# EAGLE schematic Schematics (EAGLE 7.5.0)
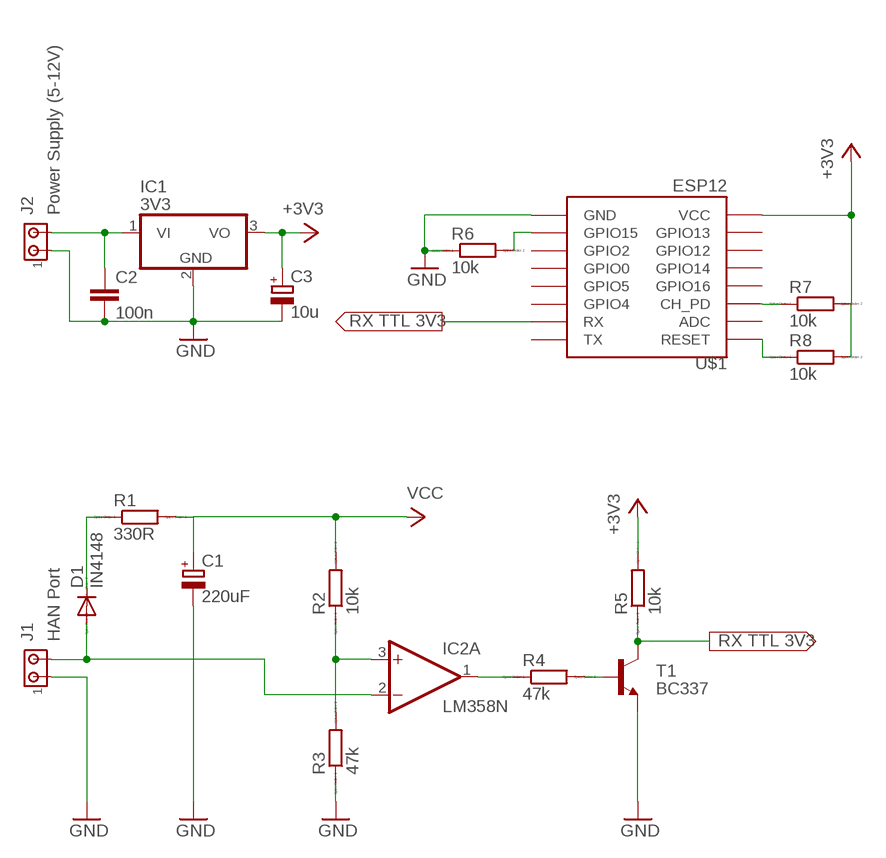
[diagram p0: schematic, sheet 1]

## Parts
C1  220uF  CPOL-EUE3.5-10  [E3,5-10]
C2  100n  C-EU025-040X050  [C025-040X050]
C3  10u  CPOL-EUB45181A  [B45181A]
D1  IN4148  1N4148DO35-7  [DO35-7]
IC1  3V3  7805TV  [TO220V]
IC2  LM358N  [DIL08]
J1  HAN Port  MTA02-156  [1X2MTA]
J2  Power Supply (5-12V)  MTA02-156  [1X2MTA]
R1  330R  R0207/10  [0207/10]
R2  10k  R0207/10  [0207/10]
R3  47k  R0207/10  [0207/10]
R4  47k  R0207/10  [0207/10]
R5  10k  R0207/10  [0207/10]
R6  10k  R0207/10  [0207/10]
R7  10k  R0207/10  [0207/10]
R8  10k  R0207/10  [0207/10]
T1  BC337  [TO92]
U$1  ESP12  [ESP12]

## Nets
+3V3: C3.+ IC1.3(VO) R5.2 R7.2 R8.2 U$1.VCC
GND: C1.- C2.2 C3.- IC1.2(GND) J1.1 J2.1 R3.1 R6.1 T1.1(E) U$1.GND
N$1: D1.A IC2.2(A:-IN) J1.2
N$2: D1.C R1.1
N$3: R7.1 U$1.CH_PD
N$4: C2.1 IC1.1(VI) J2.2
N$5: IC2.3(A:+IN) R2.1 R3.2
N$6: IC2.1(A:OUT) R4.1
N$7: R4.2 T1.2(B)
N$8: R5.1 T1.3(C)
N$9: R6.2 U$1.GPIO15
N$10: R8.1 U$1.RESET
N$11: U$1.RX
VCC: C1.+ R1.2 R2.2
Unconnected: IC2.5(B:+IN) IC2.6(B:-IN) IC2.7(B:OUT) U$1.ADC U$1.GPIO0 U$1.GPIO2 U$1.GPIO4 U$1.GPIO5 U$1.GPIO12 U$1.GPIO13 U$1.GPIO14 U$1.GPIO16 U$1.TX

## Power pins joined to a net without a drawn wire
V+: IC2.8(P:V+)
V-: IC2.4(P:V-)

## Library data of the parts
C1 C3 = resistor:CPOL-EU: POLARIZED CAPACITOR, European symbol
C2 = resistor:C-EU: CAPACITOR, European symbol
D1 = diode:1N4148: DIODE high speed (Philips)
IC1 = linear:78*: Positive VOLTAGE REGULATOR Source: http://cache.national.com/ds/LM/LM78L05.pdf http://www.fairchildsemi.com/ds/LM/LM7805.pdf
IC2 = linear:LM358: OP AMP also LM158; LM258; LM2904 Source: http://cache.national.com/ds/LM/LM158.pdf
J1 J2 = con-amp:MTA02-156: AMP connector
R1-R8 = eagle-ltspice:R: RESISTOR, European symbol; SPICEMODEL: NONE; SPICEPREFIX: R
T1 = transistor:BC337: NPN TRANSISTOR
U$1 = esp8266modules:ESP12: ESP8266 Wifi module 12